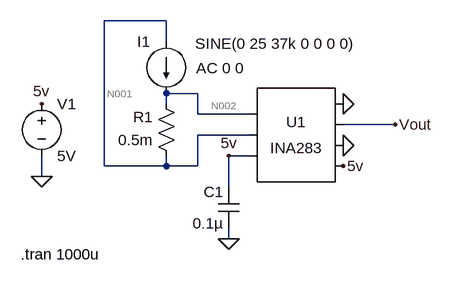
[diagram p0: schematic Draft1.asc]
* Draft1.asc
* U1: INA283 (symbol AutoGenerated\INA283 not available, pins judged from their places): pin1=N002 pin2=N001 pin3=5v pin4=0 pin5=Vout pin6=0 pin7=5v
R1 N001 N002 0.5m
V1 5v 0 5V
I1 N001 N002 SINE(0 25 37k 0 0 0 0) AC 0 0
C1 0 5v 0.1µ
.tran 1000u
.backanno
.end

* Results of the author's LTspice run, read from the files saved beside the schematic
* Operating Point, zero values left out:
*   V(5v) = 5 V
*   V(vout) = 2.498 V
*   V(n002) = 978.8 mV
*   V(n001) = 978.8 mV
*   I(V1) = -658 µA
*   Ix(u1:V+) = 581.8 µA
*   Ix(u1:GND) = -536 µA
*   Ix(u1:REF1) = -74.06 µA
*   Ix(u1:REF2) = 76.23 µA
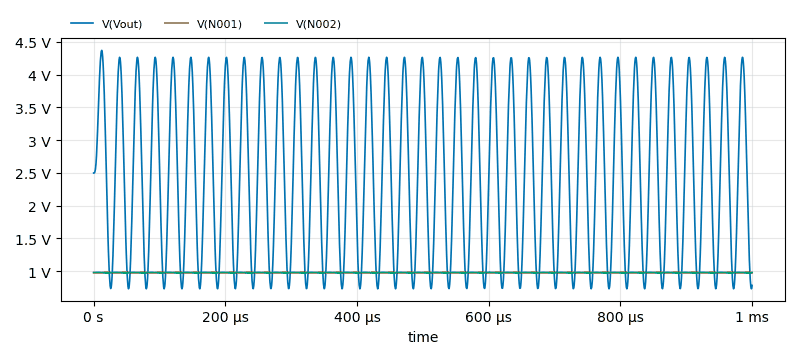
[diagram p1: Transient Analysis of Draft1.asc, plotted from the saved traces]
* Transient Analysis, 1 run:
*   V(Vout): min 732.7 mV, max 4.368 V, average 2.506 V, rms 2.801 V, last 783.9 mV
*   V(N001): min 972.7 mV, max 985 mV, average 978.8 mV, rms 978.9 mV, last 978.8 mV
*   V(N002): min 972.5 mV, max 985.2 mV, average 978.8 mV, rms 978.8 mV, last 978.8 mV